# Altium schematic sheet connectors.SchDoc: foxBMS BMS-Slave 12-Cell
size A3; DocumentNumber: 10; SheetNumber: 10; SheetTotal: 15; AUTHOR: Fraunhofer IISB foxBMS Team; SheetDescription: Connectors
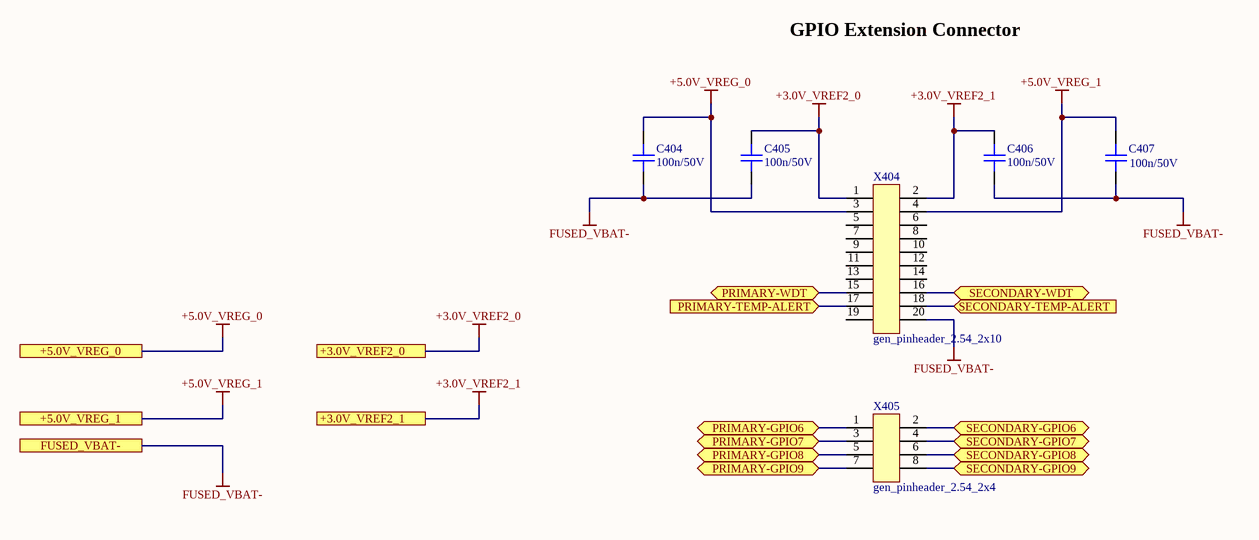
[diagram p0: connectors.SchDoc]

## Parts
C404  100n/50V  [CAPC1608X08N]
C405  100n/50V  [CAPC1608X08N]
C406  100n/50V  [CAPC1608X08N]
C407  100n/50V  [CAPC1608X08N]
X404  gen_pinheader_2.54_2x10  [Pinheader_2.54_2x10]
X405  gen_pinheader_2.54_2x4  [Pinheader_2.54_2x4]

## Ports
+3.0V_VREF2_0, +3.0V_VREF2_1, +5.0V_VREG_0, +5.0V_VREG_1, FUSED_VBAT-, PRIMARY-GPIO6 (bidir), PRIMARY-GPIO7 (bidir), PRIMARY-GPIO8 (bidir), PRIMARY-GPIO9 (bidir), PRIMARY-TEMP-ALERT (in), PRIMARY-WDT (bidir), SECONDARY-GPIO6 (bidir), SECONDARY-GPIO7 (bidir), SECONDARY-GPIO8 (bidir), SECONDARY-GPIO9 (bidir), SECONDARY-TEMP-ALERT (in), SECONDARY-WDT (bidir)

## Nets
+3.0V_VREF2_0: C405.2 X404.1 ; port +3.0V_VREF2_0
+3.0V_VREF2_1: C406.2 X404.2 ; port +3.0V_VREF2_1
+5.0V_VREG_0: C404.2 X404.3 ; port +5.0V_VREG_0
+5.0V_VREG_1: C407.2 X404.4 ; port +5.0V_VREG_1
FUSED_VBAT-: C404.1 C405.1 C406.1 C407.1 X404.20 ; port FUSED_VBAT-
PRIMARY-GPIO6: X405.1 ; port PRIMARY-GPIO6
PRIMARY-GPIO7: X405.3 ; port PRIMARY-GPIO7
PRIMARY-GPIO8: X405.5 ; port PRIMARY-GPIO8
PRIMARY-GPIO9: X405.7 ; port PRIMARY-GPIO9
PRIMARY-TEMP-ALERT: X404.17 ; port PRIMARY-TEMP-ALERT
PRIMARY-WDT: X404.15 ; port PRIMARY-WDT
SECONDARY-GPIO6: X405.2 ; port SECONDARY-GPIO6
SECONDARY-GPIO7: X405.4 ; port SECONDARY-GPIO7
SECONDARY-GPIO8: X405.6 ; port SECONDARY-GPIO8
SECONDARY-GPIO9: X405.8 ; port SECONDARY-GPIO9
SECONDARY-TEMP-ALERT: X404.18 ; port SECONDARY-TEMP-ALERT
SECONDARY-WDT: X404.16 ; port SECONDARY-WDT

Not connected (* = marked no-connect by the designer): X404 5 6 7 8 9 10 11 12 13 14 19

## Notes on the sheet
- GPIO Extension Connector
- Fraunhofer IISB
- Schottkystr. 10
- developed by:
- 91058 Erlangen
- Germany
- Author
- Project
- License
- Description
- File
- Version
- Release Date
- Sheet
- www.foxbms.org
- www.iisb.fraunhofer.de
- foxBMS Team
- /

## Library data of the parts
C404-C407 = gen_C_ceramic_100n_50V_X7R_0603: MLCC; Capacitance: 100n; Rated Voltage: 50V; Dielectric: X7R; Case EIA: 0603; Case Metric: 1608; PnP Package: C_0603_10; PnP Value: 100n/50V/X7R; PnP equipped: x; Automotive Qualified: True; Part Number: gen_C_ceramic_100n_50V_X7R_0603; Supplier 1: Farnell; Supplier Part Number 1: 2525267; Supplier 2: Digikey; Supplier Part Number 2: 490-6049-1-ND; Supplier 3: Farnell; Supplier Part Number 3: 2070398
X404 = gen_pinheader_2.54_2x10: Standard Pinheader, THD, gerade, 2.54mm, 2-reihig; Circuits: 20; Rated Voltage: 250V; Rated Current: 3A; Automotive Qualified: False; Part Number: gen_pinheader_2.54_2x10; Part Name: PinHeader; Operating Temperature: −40 °C - +105 °C; Supplier 1: Farnell; Supplier Part Number 1: 2779676
X405 = gen_pinheader_2.54_2x4: Standard Pinheader, THD, gerade, 2.54mm, 2-reihig; Circuits: 8; Rated Voltage: 250V; Rated Current: 3A; Automotive Qualified: False; Part Number: gen_pinheader_2.54_2x4; Part Name: PinHeader; Operating Temperature: −40 °C - +105 °C; Supplier 1: Farnell; Supplier Part Number 1: 2856692